# Altium schematic sheet USBPWR_SWITCH_TPS2051.SchDoc
size A3
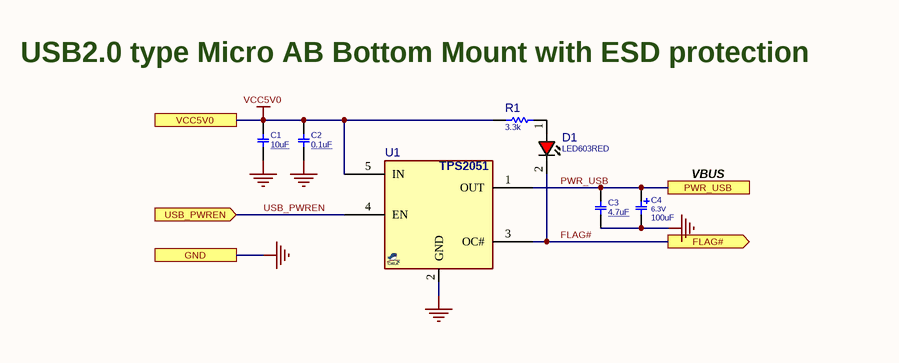
[diagram p0: USBPWR_SWITCH_TPS2051.SchDoc]

## Parts
C1  10uF  [C0603]
C2  0.1uF  [C0402]
C3  4.7uF  [C0402]
C4  PARAM2: 6.3V  [C_TN_3528]  (hidden comment: 100uF)
D1  LED603RED  [LED0603RED]
R1  3.3k  [R0402]
U1  TPS2051  [SOT23_5]  (value not drawn)

## Ports
FLAG# (out), GND, PWR_USB, USB_PWREN (in), VCC5V0

## Nets
GND: C1.2 C2.2 C3.1 C4.2 U1.2(GND) ; port GND
VCC5V0: C1.1 C2.1 R1.1 U1.5(IN) ; port VCC5V0
FLAG#: D1.2(CATHODE) U1.3(OC#) ; port FLAG#
PWR_USB: C3.2 C4.1 U1.1(OUT) ; port PWR_USB
USB_PWREN: U1.4(EN) ; port USB_PWREN
NetD1_1: D1.1(ANODE) R1.2

## Notes on the sheet
- USB2.0 type Micro AB Bottom Mount with ESD protection
- VBUS

## Library data of the parts
C1 = CAP_SMD_MLCC: C0402, MLCC, 10uF, 25V; PARAM: X5R; MANF: Murata; PARAM2: 10V; PRICE: -; DESC: -; MANF_P#: -; ASSEMBLY: ASSEMBLY; VALUE: 10uF
C2 = CAP_SMD_MLCC: C0402, MLCC, 100nF, 25V; PARAM: C0G, 10%; MANF: Murata; PARAM2: 50V; PRICE: 100= 1.4$; DESC: -; MANF_P#: -; ASSEMBLY: ASSEMBLY; VALUE: 0.1uF
C3 = CAP_SMD_MLCC: C0402, MLCC, 4.7uF, 25V; PARAM: C0G, 10%; MANF: Murata; PARAM2: 50V; PRICE: 100= 1.4$; DESC: -; MANF_P#: -; ASSEMBLY: ASSEMBLY; VALUE: 4.7uF
C4 = CAP_SMD_TAN_3528: CAP, SMD, TAN,; VALUE: 100uF
D1 = LED_SMD_0603_RED: LED, SMD, 0603, RED; PARAM: 30mA, 640nm; DESC: DESCRIPTION; MANF_P#: MANF_PART#; PARAM2: 1.8~2.5V; MANF: MANF; ASSEMBLY: ASSEMBLY; PRICE: PRICE; VALUE: LED603RED
R1 = RES_SMD: RESISTOR, SMD; PARAM: 0.063W; DESC: DESCRIPTION; DIST#: MOUSER; PARAM2: 1%; MANF_P#: -; MANF: -; ASSEMBLY: ASSEMBLY; PRICE: 100= 0.5$; VALUE: 3.3k
U1 = TPS2051_SOT23: LOAD SW,; MANF: TI; MANF_P#: TPS2051BDBV; PARAM2: 2.7~5.5V; PARAM: 0.5A, 1A limiter, -40~85oC; PRICE: 1.5$; VALUE: TPS2051